# Altium schematic sheet go_sign.SchDoc
size A4; SheetNumber: 1; SheetTotal: 2
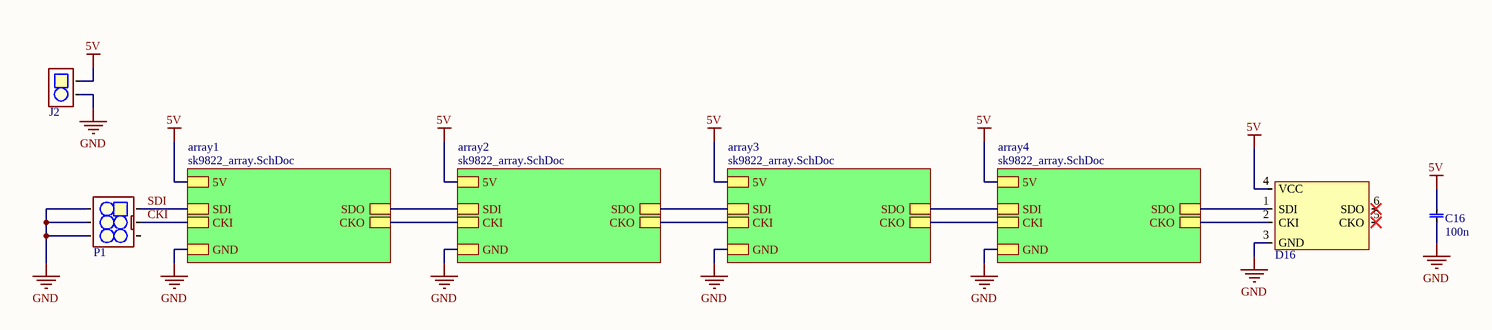
[diagram p0: go_sign.SchDoc]

## Parts
C16  value 100n  [0603 cap]  (hidden comment: 0603, capacitor)
D16  Neo - SK9822  [SK9822_FLIPPED]  (value not drawn)
J2  2 Pole MSTBA Connector  [2POLE_MSTBA]  (value not drawn)
P1  2x3 Pin Header  [2x3 PH]  (value not drawn)

## Sub-sheets
array1 = sk9822_array.SchDoc: 5V, GND, CKI, SDI, SDO, CKO
array2 = sk9822_array.SchDoc: 5V, GND, SDI, CKI, SDO, CKO
array3 = sk9822_array.SchDoc: 5V, GND, SDI, CKI, SDO, CKO
array4 = sk9822_array.SchDoc: 5V, GND, SDI, CKI, SDO, CKO

## Nets
5V: C16.1 D16.4(VCC) J2.1 ; sheet array1/5V, sheet array2/5V, sheet array3/5V, sheet array4/5V
GND: C16.0 D16.3(GND) J2.2 P1.4 P1.5 P1.6 ; sheet array1/GND, sheet array2/GND, sheet array3/GND, sheet array4/GND
CKI: P1.2 ; sheet array1/CKI
SDI: P1.1 ; sheet array1/SDI
NetD16_1: D16.1(SDI) ; sheet array4/SDO
NetD16_2: D16.2(CKI) ; sheet array4/CKO
(unnamed): sheet array1/SDO, sheet array2/SDI
(unnamed): sheet array1/CKO, sheet array2/CKI
(unnamed): sheet array2/SDO, sheet array3/SDI
(unnamed): sheet array2/CKO, sheet array3/CKI
(unnamed): sheet array3/SDO, sheet array4/SDI
(unnamed): sheet array3/CKO, sheet array4/CKI

Not connected (* = marked no-connect by the designer): D16 5(CKO)* 6(SDO)*; P1 3

## Library data of the parts
D16 = Neo - SK9822: Value: WS2812; DigiKey: 1568-1800-ND
P1 = 2x3 Ribbon connector: Value: 2x3 Pin Header, 2.54mm
C16 = 0603, capacitor: Order number: *